# Altium project STM32F407VG.PrjPcb
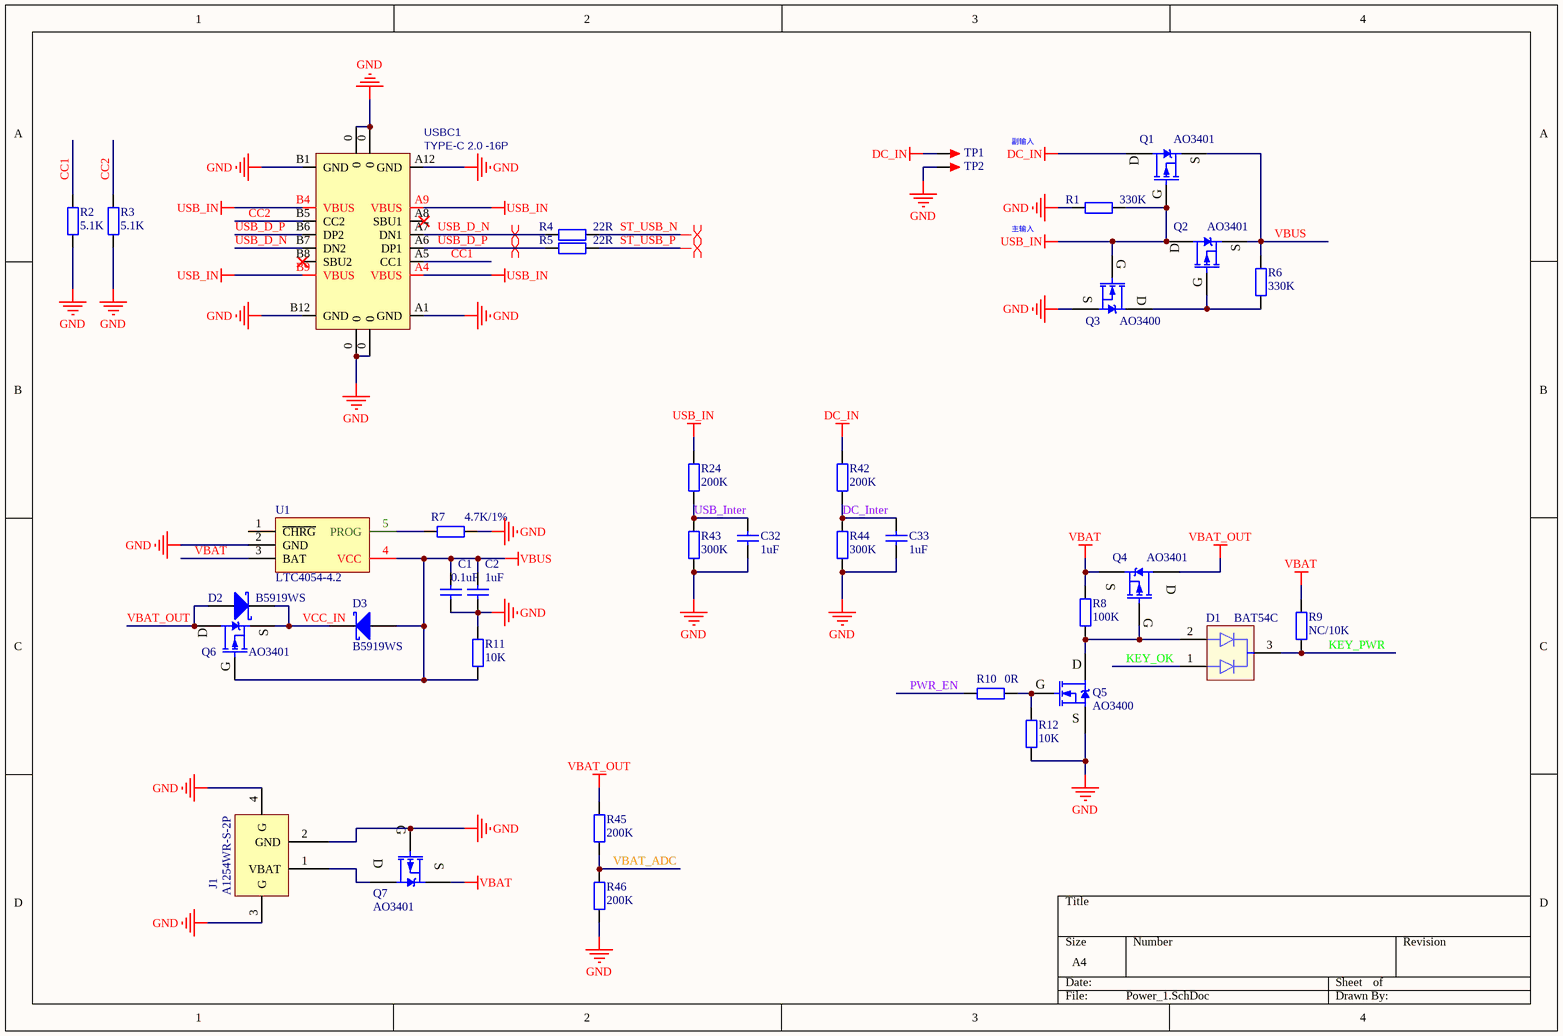
[diagram p0: Power_1.SchDoc]
8 sheets, 128 parts. Net scope: global (net labels, ports and power ports of the same name join across sheets).
Board files: STM32F407VG.PcbDoc, 板框.PcbDoc
Sheets:
  Power_1.SchDoc
  Power_2.SchDoc
  STM32F407VG_A.SchDoc
  STM32F407VG_B.SchDoc
  Flash.SchDoc
  SDCard.SchDoc
  ICM20608.SchDoc
  LCD_ADS131A04.SchDoc

## Sheet Power_1.SchDoc
size A4; SheetNumber: 1; SheetTotal: 8

### Parts
C1  0.1uF  [C0402_L]
C2  1uF  [C0402_L]
C32  1uF  [C0402_L]
C33  1uF  [C0402_L]
D1  BAT54C  [SOT23-3L]
D2  B5919WS  [SOD-123F]
D3  B5919WS  [SOD-123F]
J1  A1254WR-S-2P  [A1254WR-S-2P]
Q1  AO3401  [SOT23-3L]
Q2  AO3401  [SOT23-3L]
Q3  AO3400  [SOT23-3L]
Q4  AO3401  [SOT23-3L]
Q5  AO3400  [SOT23-3L]
Q6  AO3401  [SOT23-3L]
Q7  AO3401  [SOT23-3L]
R1  330K  [R0402_L]
R2  5.1K  [R0402_L]
R3  5.1K  [R0402_L]
R4  22R  [R0402_L]
R5  22R  [R0402_L]
R6  330K  [R0402_L]
R7  4.7K/1%  [R0402_L]
R8  100K  [R0402_L]
R9  NC/10K  [R0402_L]
R10  0R  [R0402_L]
R11  10K  [R0402_L]
R12  10K  [R0402_L]
R24  200K  [R0402_L]
R42  200K  [R0402_L]
R43  300K  [R0402_L]
R44  300K  [R0402_L]
R45  200K  [R0402_L]
R46  200K  [R0402_L]
TP1  TEST  [TEST 1]  (value not drawn)
TP2  TEST  [TEST 1]  (value not drawn)
U1  LTC4054-4.2  [SOT23-5L]
USBC1  TYPE-C 2.0 -16P  [USB-C-SMD_16P]

### Nets
DC_IN: Q1.3(D) R42.2 TP1.1
GND: C1.2 C2.2 C32.1 C33.1 J1.2(GND) J1.3(G) J1.4(G) Q3.2(S) Q5.2(S) Q7.1(G) R1.1 R2.1 R3.1 R7.2 R11.2 R12.2 R43.1 R44.1 R46.1 TP2.1 U1.2(GND) USBC1.0 USBC1.A1(GND) USBC1.A12(GND) USBC1.B1(GND) USBC1.B12(GND)
USB_IN: Q1.1(G) Q2.3(D) Q3.1(G) R1.2 R24.2 USBC1.A4(VBUS) USBC1.A9(VBUS) USBC1.B4(VBUS) USBC1.B9(VBUS)
VBAT: Q4.2(S) Q7.2(S) R8.2 R9.2 U1.3(BAT)
VBAT_OUT: D2.1(A) Q4.3(D) Q6.3(D) R45.2
VBUS: C1.1 C2.1 D3.1(A) Q1.2(S) Q2.2(S) Q6.1(G) R6.2 R11.1 U1.4(VCC)
VCC_IN: D2.2(K) D3.2(K) Q6.2(S)
CC1: R2.2 USBC1.A5(CC1)
CC2: R3.2 USBC1.B5(CC2)
DC_Inter: C33.2 R42.1 R44.2
KEY_OK: D1.1
KEY_PWR: D1.3 R9.1
PWR_EN: R10.2
ST_USB_N: R4.2
ST_USB_P: R5.2
USB_D_N: R4.1 USBC1.A7(DN1) USBC1.B7(DN2)
USB_D_P: R5.1 USBC1.A6(DP1) USBC1.B6(DP2)
USB_Inter: C32.2 R24.1 R43.2
VBAT_ADC: R45.1 R46.2  [project net ADC1_IN1]
NetD1_2: D1.2 Q4.1(G) Q5.3(D) R8.1
NetJ1_1: J1.1(VBAT) Q7.3(D)
NetQ2_1: Q2.1(G) Q3.3(D) R6.1
NetQ5_1: Q5.1(G) R10.1 R12.1
NetR7_1: R7.1 U1.5(PROG)

Not connected (* = marked no-connect by the designer): U1 1(~{CHRG}); USBC1 A8(SBU1)* B8(SBU2)*

### Layout directives
differential pair: ST_USB_N, ST_USB_P, USB_D_N, USB_D_P

### Notes on the sheet
- 副输入
- 主输入

### Library data of the parts
C1 C2 C32 C33 = C: 贴片电容; BOM名称: 无极性贴片电容; 联系卖家，免费查找封装: 唯一出售店铺网址https://shop463601444.taobao.com
D1 = BAT54C: 共阴肖特基二极管
D2 D3 = 1N5819: 肖特基二极管; 联系卖家，免费查找封装: 唯一出售店铺网址https://shop463601444.taobao.com; BOM名称: 肖特基二极管
J1 = A1254WR-S-2P: 长江连接器-卧式-2P
Q1 Q2 Q4 Q6 Q7 = AO3401: P沟道 30V/4.2A; BOM名称: 场效应管; 联系卖家，免费查找封装: 唯一出售店铺网址https://shop463601444.taobao.com; 参数: P沟道 30V/4.2A
Q3 Q5 = AO3400: N沟道 30V/4.2A; BOM名称: 场效应管; 联系卖家，免费查找封装: 唯一出售店铺网址https://shop463601444.taobao.com; 参数: N沟道 30V/4.2A
R1-R12 R24 R42-R46 = R: 贴片电阻; 联系卖家，免费查找封装: 唯一出售店铺网址https://shop463601444.taobao.com; BOM名称: 贴片电阻
TP1 TP2 = TEST: 测试点; 联系卖家，免费查找封装: 唯一出售店铺网址https://shop463601444.taobao.com; 封装库来自淘宝卖家ID：黄晶宝石: 其他店铺购入均为盗版假冒封装库，请立即申请退款; BOM名称: 测试点
U1 = LTC4054-4.2: 锂电池充电IC
USBC1 = USB2.0_Type-C_16Pin: USB2.0_Type-C_16Pin母座; 联系卖家 免费查找封装: 唯一出售店铺网址https://shop463601444.taobao.com; 联系卖家 免费技术支持: 封装库来自淘宝卖家ID：黄晶宝石

## Sheet Power_2.SchDoc
size A4; SheetNumber: 2; SheetTotal: 8
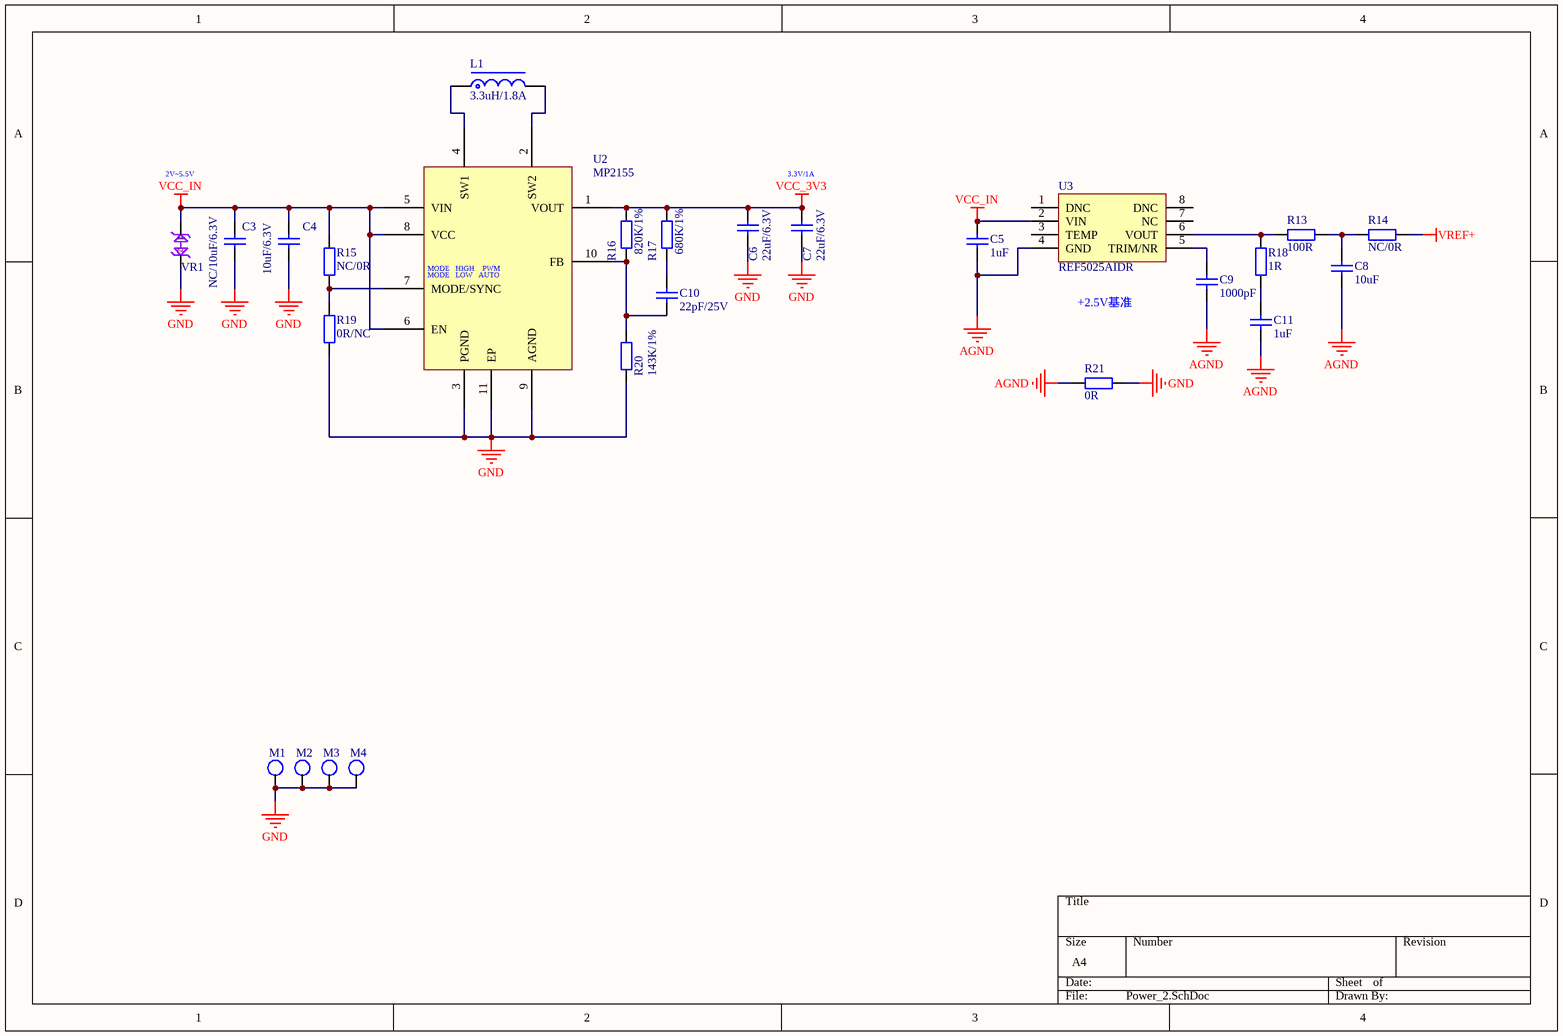
[diagram p1: Power_2.SchDoc]

### Parts
C3  NC/10uF/6.3V  [C0603_L]
C4  10uF/6.3V  [C0603_L]
C5  1uF  [C0402_L]
C6  22uF/6.3V  [C0603_L]
C7  22uF/6.3V  [C0603_L]
C8  10uF  [C0603_L]
C9  1000pF  [C0402_L]
C10  22pF/25V  [C0402_L]
C11  1uF  [C0402_L]
L1  3.3uH/1.8A  [NR2520]
M1  M2  [M2]  (value not drawn)
M2  M2  [M2]  (value not drawn)
M3  M2  [M2]  (value not drawn)
M4  M2  [M2]  (value not drawn)
R13  100R  [R0402_L]
R14  NC/0R  [R0402_L]
R15  NC/0R  [R0402_L]
R16  820K/1%  [R0402_L]
R17  680K/1%  [R0402_L]
R18  1R  [R0402_L]
R19  0R/NC  [R0402_L]
R20  143K/1%  [R0402_L]
R21  0R  [R0402_L]
U2  MP2155  [QFN10(3mmX3mm)]
U3  REF5025AIDR  [SOIC-8L]
VR1  UAD8C05L01  [SOD882]  (value not drawn)

### Nets
AGND: C5.1 C8.1 C9.1 C11.1 R21.1 U3.4(GND)
GND: C3.1 C4.1 C6.1 C7.1 M1.1 M2.1 M3.1 M4.1 R19.1 R20.1 R21.2 U2.3(PGND) U2.9(AGND) U2.11(EP) VR1.2
VCC_3V3: C6.2 C7.2 R16.2 R17.2 U2.1(VOUT)
VCC_IN: C3.2 C4.2 C5.2 R15.2 U2.5(VIN) U2.6(EN) U2.8(VCC) U3.2(VIN) VR1.1
VREF+: R14.2
NetC8_2: C8.2 R13.2 R14.1
NetC9_2: C9.2 U3.5(TRIM/NR)
NetC10_1: C10.1 R16.1 R20.2 U2.10(FB)
NetC10_2: C10.2 R17.1
NetC11_2: C11.2 R18.1
NetL1_1: L1.1 U2.4(SW1)
NetL1_2: L1.2 U2.2(SW2)
NetR13_1: R13.1 R18.2 U3.6(VOUT)
NetR15_1: R15.1 R19.2 U2.7(MODE/SYNC)

Not connected (* = marked no-connect by the designer): U3 1(DNC) 3(TEMP) 7(NC) 8(DNC)

### Notes on the sheet
- 2V~5.5V
- 3.3V/1A
- (near U2) MODE   HIGH    PWM
- (near U2) MODE   LOW   AUTO
- +2.5V基准

### Library data of the parts
C3-C11 = C: as C1 on sheet Power_1
L1 = L-NR: 太诱-NR磁胶电感; BOM名称: NR磁胶电感; 联系卖家，免费查找封装: 唯一出售店铺网址https://shop463601444.taobao.com
M1-M4 = M2系列: M2孔支撑柱
R13-R21 = R: as R1 on sheet Power_1; BOM名称: 贴片电阻
U2 = MP2155: 高效、低静态电流的Buck-Boost变换器
U3 = REF5025AIDR: 3uVpp/V噪声 3ppm/℃漂移 电压基准 0.05%

## Sheet STM32F407VG_A.SchDoc
size A4; SheetNumber: 3; SheetTotal: 8
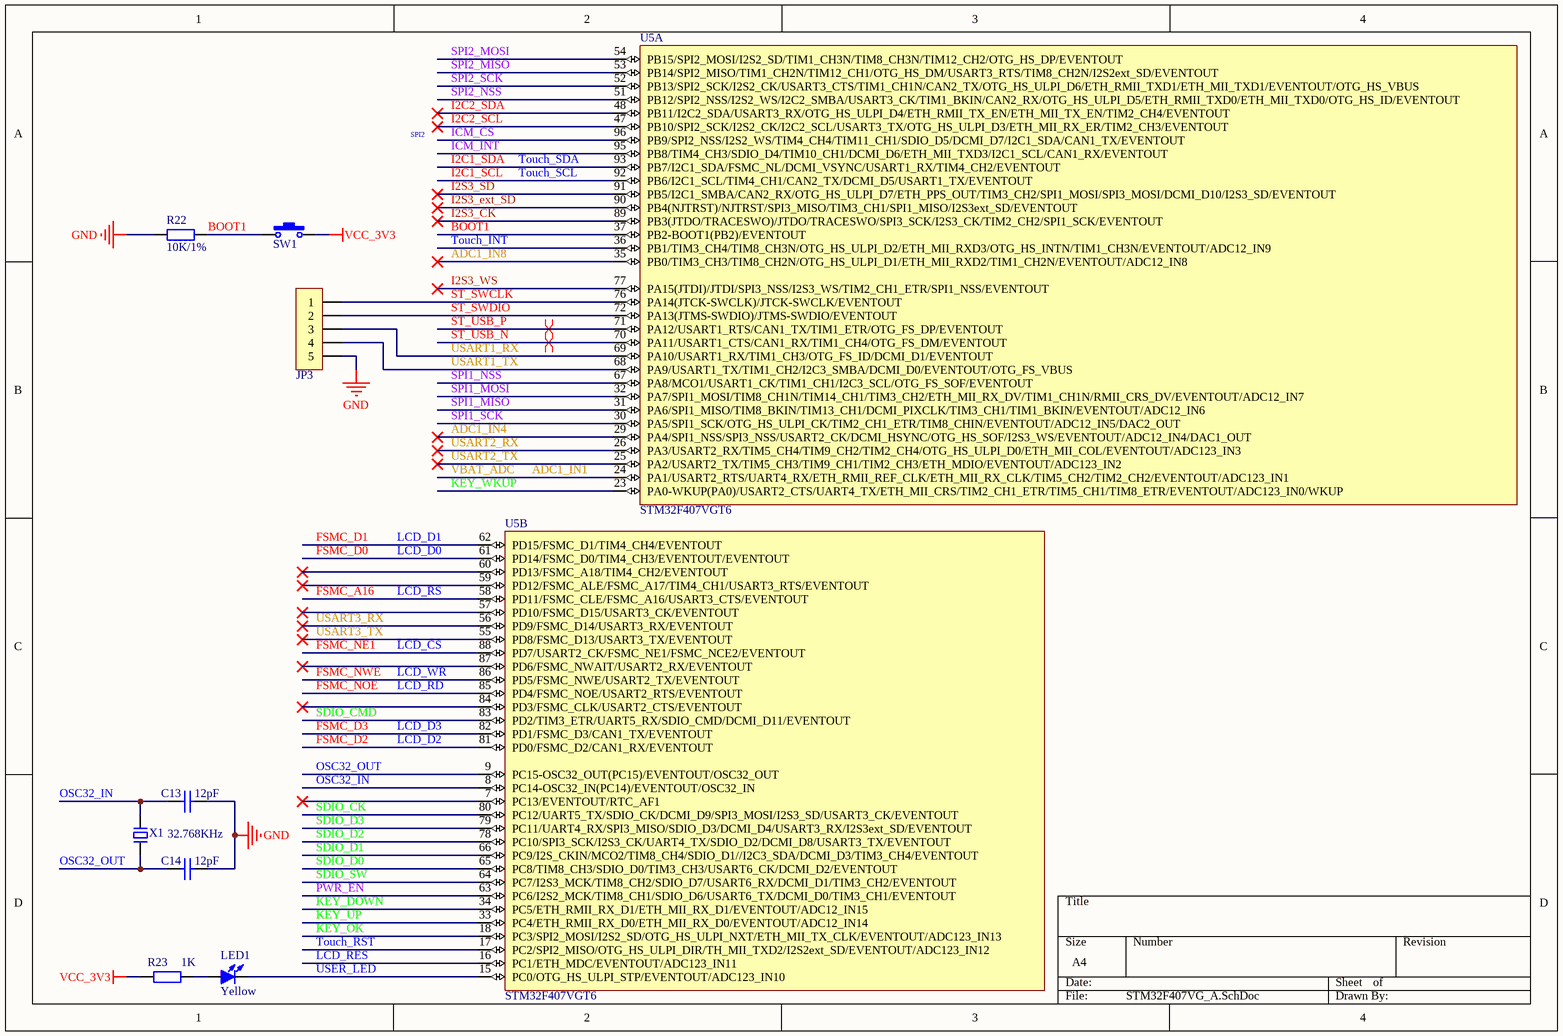
[diagram p2: STM32F407VG_A.SchDoc]

### Parts
C13  12pF  [C0402_L]
C14  12pF  [C0402_L]
JP3  HDR-1X5  [HDR1.27-LI-5P]  (value not drawn)
LED1  Yellow  [LED0402]
R22  10K/1%  [R0402_L]
R23  1K  [R0402_L]
SW1  小龟按键  [3*4两脚小龟按键]  (value not drawn)
U5  STM32F407VGT6  [LQFP100_L]  (parts A,B of 5)
X1  32.768KHz  [XTAL-3215-2P]

### Nets
GND: C13.1 C14.1 JP3.5 R22.1
VCC_3V3: R23.1 SW1.2
ADC1_IN1: U5.24(PA1/USART2_RTS/UART4_RX/ETH_RMII_REF_CLK/ETH_MII_RX_CLK/TIM5_CH2/TIM2_CH2/EVENTOUT/ADC123_IN1)  [also labelled VBAT_ADC]
ADC1_IN4: U5.29(PA4/SPI1_NSS/SPI3_NSS/USART2_CK/DCMI_HSYNC/OTG_HS_SOF/I2S3_WS/EVENTOUT/ADC12_IN4/DAC1_OUT)
ADC1_IN8: U5.35(PB0/TIM3_CH3/TIM8_CH2N/OTG_HS_ULPI_D1/ETH_MII_RXD2/TIM1_CH2N/EVENTOUT/ADC12_IN8)
BOOT1: R22.2 SW1.1 U5.37(PB2-BOOT1(PB2)/EVENTOUT)
FSMC_A16: U5.58(PD11/FSMC_CLE/FSMC_A16/USART3_CTS/EVENTOUT)  [also labelled LCD_RS]
FSMC_D0: U5.61(PD14/FSMC_D0/TIM4_CH3/EVENTOUT/EVENTOUT)  [also labelled LCD_D0]
FSMC_D1: U5.62(PD15/FSMC_D1/TIM4_CH4/EVENTOUT)  [also labelled LCD_D1]
FSMC_D2: U5.81(PD0/FSMC_D2/CAN1_RX/EVENTOUT)  [also labelled LCD_D2]
FSMC_D3: U5.82(PD1/FSMC_D3/CAN1_TX/EVENTOUT)  [also labelled LCD_D3]
FSMC_NE1: U5.88(PD7/USART2_CK/FSMC_NE1/FSMC_NCE2/EVENTOUT)  [also labelled LCD_CS]
FSMC_NOE: U5.85(PD4/FSMC_NOE/USART2_RTS/EVENTOUT)  [also labelled LCD_RD]
FSMC_NWE: U5.86(PD5/FSMC_NWE/USART2_TX/EVENTOUT)  [also labelled LCD_WR]
I2C1_SCL: U5.92(PB6/I2C1_SCL/TIM4_CH1/CAN2_TX/DCMI_D5/USART1_TX/EVENTOUT)  [also labelled Touch_SCL]
I2C1_SDA: U5.93(PB7/I2C1_SDA/FSMC_NL/DCMI_VSYNC/USART1_RX/TIM4_CH2/EVENTOUT)  [also labelled Touch_SDA]
I2C2_SCL: U5.47(PB10/SPI2_SCK/I2S2_CK/I2C2_SCL/USART3_TX/OTG_HS_ULPI_D3/ETH_MII_RX_ER/TIM2_CH3/EVENTOUT)
I2C2_SDA: U5.48(PB11/I2C2_SDA/USART3_RX/OTG_HS_ULPI_D4/ETH_RMII_TX_EN/ETH_MII_TX_EN/TIM2_CH4/EVENTOUT)
I2S3_CK: U5.89(PB3(JTDO/TRACESWO)/JTDO/TRACESWO/SPI3_SCK/I2S3_CK/TIM2_CH2/SPI1_SCK/EVENTOUT)
I2S3_ext_SD: U5.90(PB4(NJTRST)/NJTRST/SPI3_MISO/TIM3_CH1/SPI1_MISO/I2S3ext_SD/EVENTOUT)
I2S3_SD: U5.91(PB5/I2C1_SMBA/CAN2_RX/OTG_HS_ULPI_D7/ETH_PPS_OUT/TIM3_CH2/SPI1_MOSI/SPI3_MOSI/DCMI_D10/I2S3_SD/EVENTOUT)
I2S3_WS: U5.77(PA15(JTDI)/JTDI/SPI3_NSS/I2S3_WS/TIM2_CH1_ETR/SPI1_NSS/EVENTOUT)
ICM_CS: U5.96(PB9/SPI2_NSS/I2S2_WS/TIM4_CH4/TIM11_CH1/SDIO_D5/DCMI_D7/I2C1_SDA/CAN1_TX/EVENTOUT)
ICM_INT: U5.95(PB8/TIM4_CH3/SDIO_D4/TIM10_CH1/DCMI_D6/ETH_MII_TXD3/I2C1_SCL/CAN1_RX/EVENTOUT)
KEY_DOWN: U5.34(PC5/ETH_RMII_RX_D1/ETH_MII_RX_D1/EVENTOUT/ADC12_IN15)
KEY_OK: U5.18(PC3/SPI2_MOSI/I2S2_SD/OTG_HS_ULPI_NXT/ETH_MII_TX_CLK/EVENTOUT/ADC123_IN13)
KEY_UP: U5.33(PC4/ETH_RMII_RX_D0/ETH_MII_RX_D0/EVENTOUT/ADC12_IN14)
KEY_WKUP: U5.23(PA0-WKUP(PA0)/USART2_CTS/UART4_TX/ETH_MII_CRS/TIM2_CH1_ETR/TIM5_CH1/TIM8_ETR/EVENTOUT/ADC123_IN0/WKUP)
LCD_RES: U5.16(PC1/ETH_MDC/EVENTOUT/ADC123_IN11)
OSC32_IN: C13.2 U5.8(PC14-OSC32_IN(PC14)/EVENTOUT/OSC32_IN) X1.2
OSC32_OUT: C14.2 U5.9(PC15-OSC32_OUT(PC15)/EVENTOUT/OSC32_OUT) X1.1
PWR_EN: U5.63(PC6/I2S2_MCK/TIM8_CH1/SDIO_D6/USART6_TX/DCMI_D0/TIM3_CH1/EVENTOUT)
SDIO_CK: U5.80(PC12/UART5_TX/SDIO_CK/DCMI_D9/SPI3_MOSI/I2S3_SD/USART3_CK/EVENTOUT)
SDIO_CMD: U5.83(PD2/TIM3_ETR/UART5_RX/SDIO_CMD/DCMI_D11/EVENTOUT)
SDIO_D0: U5.65(PC8/TIM8_CH3/SDIO_D0/TIM3_CH3/USART6_CK/DCMI_D2/EVENTOUT)
SDIO_D1: U5.66(PC9/I2S_CKIN/MCO2/TIM8_CH4/SDIO_D1//I2C3_SDA/DCMI_D3/TIM3_CH4/EVENTOUT)
SDIO_D2: U5.78(PC10/SPI3_SCK/I2S3_CK/UART4_TX/SDIO_D2/DCMI_D8/USART3_TX/EVENTOUT)
SDIO_D3: U5.79(PC11/UART4_RX/SPI3_MISO/SDIO_D3/DCMI_D4/USART3_RX/I2S3ext_SD/EVENTOUT)
SDIO_SW: U5.64(PC7/I2S3_MCK/TIM8_CH2/SDIO_D7/USART6_RX/DCMI_D1/TIM3_CH2/EVENTOUT)
SPI1_MISO: U5.31(PA6/SPI1_MISO/TIM8_BKIN/TIM13_CH1/DCMI_PIXCLK/TIM3_CH1/TIM1_BKIN/EVENTOUT/ADC12_IN6)
SPI1_MOSI: U5.32(PA7/SPI1_MOSI/TIM8_CH1N/TIM14_CH1/TIM3_CH2/ETH_MII_RX_DV/TIM1_CH1N/RMII_CRS_DV/EVENTOUT/ADC12_IN7)
SPI1_NSS: U5.67(PA8/MCO1/USART1_CK/TIM1_CH1/I2C3_SCL/OTG_FS_SOF/EVENTOUT)
SPI1_SCK: U5.30(PA5/SPI1_SCK/OTG_HS_ULPI_CK/TIM2_CH1_ETR/TIM8_CHIN/EVENTOUT/ADC12_IN5/DAC2_OUT)
SPI2_MISO: U5.53(PB14/SPI2_MISO/TIM1_CH2N/TIM12_CH1/OTG_HS_DM/USART3_RTS/TIM8_CH2N/I2S2ext_SD/EVENTOUT)
SPI2_MOSI: U5.54(PB15/SPI2_MOSI/I2S2_SD/TIM1_CH3N/TIM8_CH3N/TIM12_CH2/OTG_HS_DP/EVENTOUT)
SPI2_NSS: U5.51(PB12/SPI2_NSS/I2S2_WS/I2C2_SMBA/USART3_CK/TIM1_BKIN/CAN2_RX/OTG_HS_ULPI_D5/ETH_RMII_TXD0/ETH_MII_TXD0/OTG_HS_ID/EVENTOUT)
SPI2_SCK: U5.52(PB13/SPI2_SCK/I2S2_CK/USART3_CTS/TIM1_CH1N/CAN2_TX/OTG_HS_ULPI_D6/ETH_RMII_TXD1/ETH_MII_TXD1/EVENTOUT/OTG_HS_VBUS)
ST_SWCLK: JP3.1 U5.76(PA14(JTCK-SWCLK)/JTCK-SWCLK/EVENTOUT)
ST_SWDIO: JP3.2 U5.72(PA13(JTMS-SWDIO)/JTMS-SWDIO/EVENTOUT)
ST_USB_N: U5.70(PA11/USART1_CTS/CAN1_RX/TIM1_CH4/OTG_FS_DM/EVENTOUT)
ST_USB_P: U5.71(PA12/USART1_RTS/CAN1_TX/TIM1_ETR/OTG_FS_DP/EVENTOUT)
Touch_INT: U5.36(PB1/TIM3_CH4/TIM8_CH3N/OTG_HS_ULPI_D2/ETH_MII_RXD3/OTG_HS_INTN/TIM1_CH3N/EVENTOUT/ADC12_IN9)
Touch_RST: U5.17(PC2/SPI2_MISO/OTG_HS_ULPI_DIR/TH_MII_TXD2/I2S2ext_SD/EVENTOUT/ADC123_IN12)
USART1_RX: JP3.3 U5.69(PA10/USART1_RX/TIM1_CH3/OTG_FS_ID/DCMI_D1/EVENTOUT)
USART1_TX: JP3.4 U5.68(PA9/USART1_TX/TIM1_CH2/I2C3_SMBA/DCMI_D0/EVENTOUT/OTG_FS_VBUS)
USART2_RX: U5.26(PA3/USART2_RX/TIM5_CH4/TIM9_CH2/TIM2_CH4/OTG_HS_ULPI_D0/ETH_MII_COL/EVENTOUT/ADC123_IN3)
USART2_TX: U5.25(PA2/USART2_TX/TIM5_CH3/TIM9_CH1/TIM2_CH3/ETH_MDIO/EVENTOUT/ADC123_IN2)
USART3_RX: U5.56(PD9/FSMC_D14/USART3_RX/EVENTOUT)
USART3_TX: U5.55(PD8/FSMC_D13/USART3_TX/EVENTOUT)
USER_LED: LED1.2(K) U5.15(PC0/OTG_HS_ULPI_STP/EVENTOUT/ADC123_IN10)
NetLED1_1: LED1.1(A) R23.2

Not connected (* = marked no-connect by the designer): U5 7(PC13/EVENTOUT/RTC_AF1)* 57(PD10/FSMC_D15/USART3_CK/EVENTOUT)* 59(PD12/FSMC_ALE/FSMC_A17/TIM4_CH1/USART3_RTS/EVENTOUT)* 60(PD13/FSMC_A18/TIM4_CH2/EVENTOUT)* 84(PD3/FSMC_CLK/USART2_CTS/EVENTOUT)* 87(PD6/FSMC_NWAIT/USART2_RX/EVENTOUT)*

### Layout directives
differential pair: ST_USB_N, ST_USB_P

### Notes on the sheet
- SPI2

### Library data of the parts
C13 C14 = C: as C1 on sheet Power_1
JP3 = Header 5: 5P接插件; 封装库来自淘宝卖家 ID：黄晶宝石: https://shop463601444.taobao.com
LED1 = LED-SMD: 贴片LED; 联系卖家 免费查找封装: 封装库来自淘宝卖家ID：黄晶宝石; BOM名称: 贴片LED
R22 R23 = R: as R1 on sheet Power_1; BOM名称: 贴片电阻
SW1 = SW-PB: 微动开关; BOM名称: 3x6轻触开关; 联系卖家，免费查找封装: 唯一出售店铺网址https://shop463601444.taobao.com; 封装库来自淘宝卖家ID：黄晶宝石: 其他店铺购入均为盗版假冒封装库，请立即申请退款
U5 = STM32F407VGT6: ARM Cortex-M4 32b MCU+FPU, 210DMIP, 1024 kB Flash, 192+4 kB RAM, Camera, 82 I/Os, 100-pin LQFP, -40 to +85癈, Tray; Internal RAM: 192kB; Operating Frequency (Processor Speed): 168MHz; A/D Converter: 16x12-bit; D/A Converter: 2x12-bit; 16-bit Timers (IC/OC/PWM): 12x16-bit(24/24/30); 32-bit Timer (IC/OC/PWM): 2x32-bit (8/8/8); Other Timer Functions: 2xWDG, RTC, 24-bit down counter; Serial Interface: 3xSPI/2xI2S/2xI2C/3xUSART(IrDa, ISO7816)/3xUART/2xUSB OTG FS/HS, 2xCAN/Ethernet MAC10/100, SDIO; 联系卖家，免费查找封装: 唯一出售店铺网址https://shop463601444.taobao.com; DatasheetVersion: rev2, Jan-2012; PackageVersion: 2012; PackageReference: LQFP100; PackageDescription: 100-Pin Low Profile Quad Flat Package, 14x14 mm Body, 0.5 mm Pitch; ComponentLink1Description: Manufacturer URL; ComponentLink1URL: http://www.st.com/; ComponentLink2Description: STM32F405/7 Datasheet; ComponentLink2URL: http://www.st.com/internet/com/TECHNICAL_RESOURCES/TECHNICAL_LITERATURE/DATASHEET/DM00037051.pdf; ComponentLink3Description: STM32F4 Web Page; ComponentLink3URL: http://www.st.com/internet/mcu/subclass/1521.jsp
X1 = XTAL-2P: 2脚无源晶振(谐振器）; 联系卖家，免费查找封装: 唯一出售店铺网址https://shop463601444.taobao.com; BOM名称: 2脚无源晶振(谐振器）

## Sheet STM32F407VG_B.SchDoc
size A4; SheetNumber: 4; SheetTotal: 8
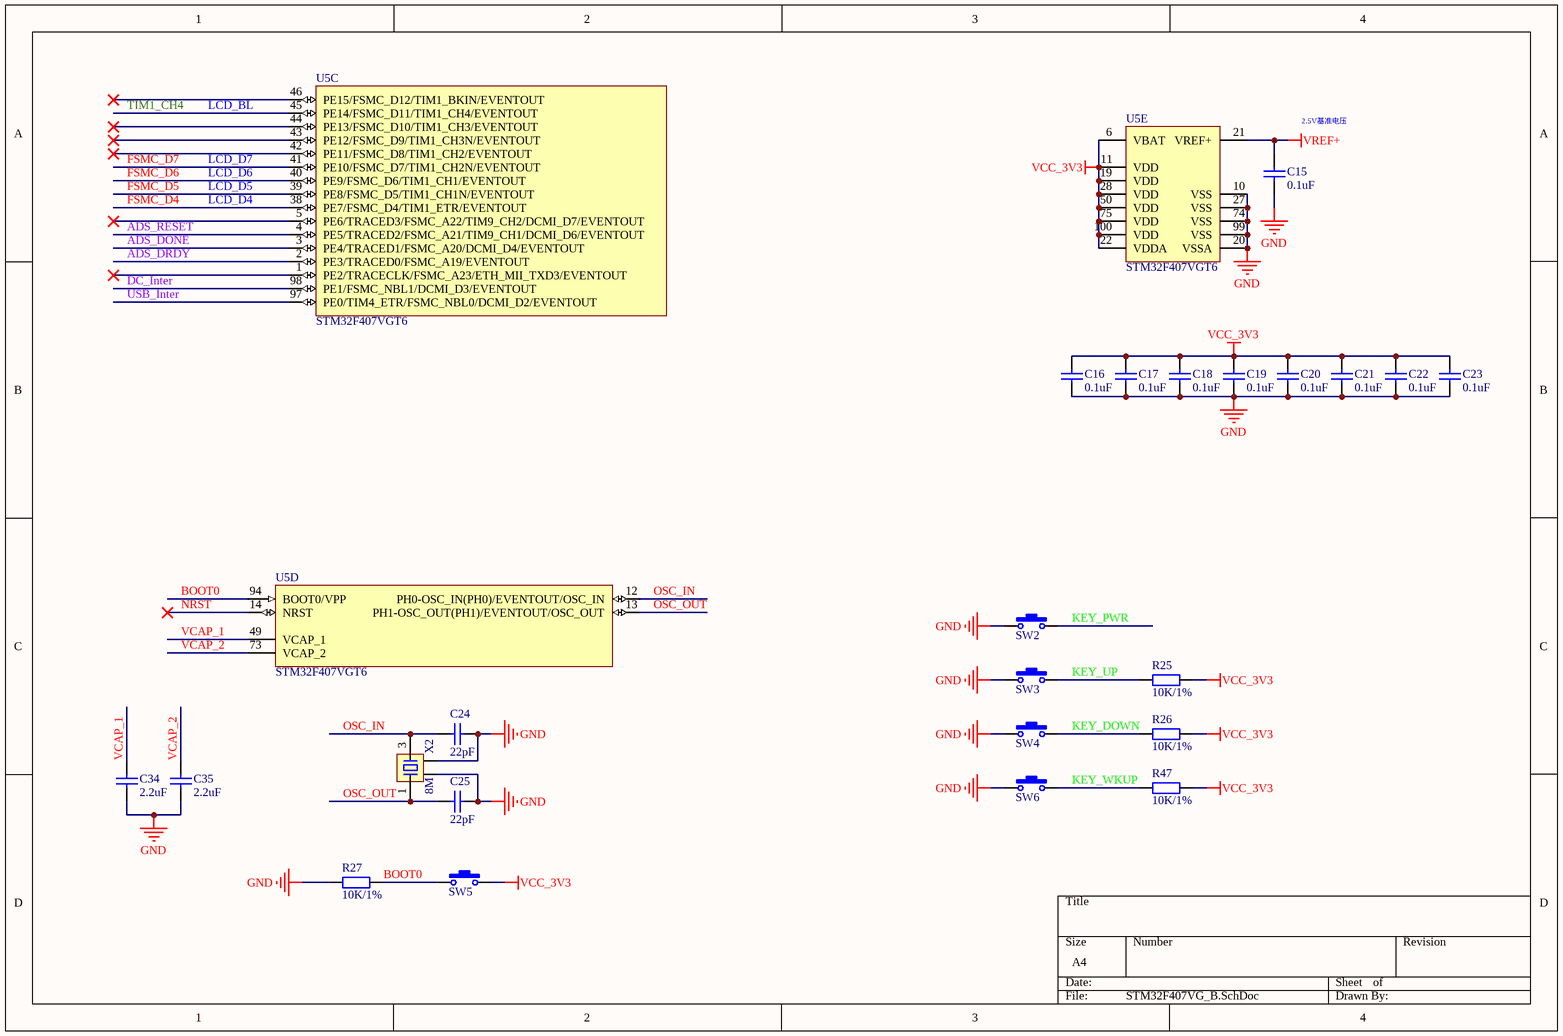
[diagram p3: STM32F407VG_B.SchDoc]

### Parts
C15  0.1uF  [C0402_L]
C16  0.1uF  [C0402_L]
C17  0.1uF  [C0402_L]
C18  0.1uF  [C0402_L]
C19  0.1uF  [C0402_L]
C20  0.1uF  [C0402_L]
C21  0.1uF  [C0402_L]
C22  0.1uF  [C0402_L]
C23  0.1uF  [C0402_L]
C24  22pF  [C0402_L]
C25  22pF  [C0402_L]
C34  2.2uF  [C0402_L]
C35  2.2uF  [C0402_L]
R25  10K/1%  [R0402_L]
R26  10K/1%  [R0402_L]
R27  10K/1%  [R0402_L]
R47  10K/1%  [R0402_L]
SW2  小龟按键  [2*4*3.5]  (value not drawn)
SW3  小龟按键  [2*4*3.5]  (value not drawn)
SW4  小龟按键  [2*4*3.5]  (value not drawn)
SW5  小龟按键  [3*4两脚小龟按键]  (value not drawn)
SW6  小龟按键  [2*4*3.5]  (value not drawn)
U5  STM32F407VGT6  [LQFP100_L]  (parts C,D,E of 5)
X2  8M  [XTAL-3225-4P]

### Nets
GND: C15.1 C16.1 C17.1 C18.1 C19.1 C20.1 C21.1 C22.1 C23.1 C24.2 C25.2 C34.1 C35.1 R27.1 SW2.1 SW3.1 SW4.1 SW6.1 U5.10(VSS) U5.20(VSSA) U5.27(VSS) U5.74(VSS) U5.99(VSS) X2.2 X2.4
VCC_3V3: C16.2 C17.2 C18.2 C19.2 C20.2 C21.2 C22.2 C23.2 R25.2 R26.2 R47.2 SW5.2 U5.6(VBAT) U5.11(VDD) U5.19(VDD) U5.22(VDDA) U5.28(VDD) U5.50(VDD) U5.75(VDD) U5.100(VDD)
VREF+: C15.2 U5.21(VREF+)
ADS_DONE: U5.3(PE4/TRACED1/FSMC_A20/DCMI_D4/EVENTOUT)
ADS_DRDY: U5.2(PE3/TRACED0/FSMC_A19/EVENTOUT)
ADS_RESET: U5.4(PE5/TRACED2/FSMC_A21/TIM9_CH1/DCMI_D6/EVENTOUT)
BOOT0: R27.2 SW5.1 U5.94(BOOT0/VPP)
DC_Inter: U5.98(PE1/FSMC_NBL1/DCMI_D3/EVENTOUT)
FSMC_D4: U5.38(PE7/FSMC_D4/TIM1_ETR/EVENTOUT)  [also labelled LCD_D4]
FSMC_D5: U5.39(PE8/FSMC_D5/TIM1_CH1N/EVENTOUT)  [also labelled LCD_D5]
FSMC_D6: U5.40(PE9/FSMC_D6/TIM1_CH1/EVENTOUT)  [also labelled LCD_D6]
FSMC_D7: U5.41(PE10/FSMC_D7/TIM1_CH2N/EVENTOUT)  [also labelled LCD_D7]
KEY_DOWN: R26.1 SW4.2
KEY_PWR: SW2.2
KEY_UP: R25.1 SW3.2
KEY_WKUP: R47.1 SW6.2
LCD_BL: U5.45(PE14/FSMC_D11/TIM1_CH4/EVENTOUT)  [also labelled TIM1_CH4]
NRST: U5.14(NRST)
OSC_IN: C24.1 U5.12(PH0-OSC_IN(PH0)/EVENTOUT/OSC_IN) X2.3
OSC_OUT: C25.1 U5.13(PH1-OSC_OUT(PH1)/EVENTOUT/OSC_OUT) X2.1
USB_Inter: U5.97(PE0/TIM4_ETR/FSMC_NBL0/DCMI_D2/EVENTOUT)
VCAP_1: C34.2 U5.49(VCAP_1)
VCAP_2: C35.2 U5.73(VCAP_2)

Not connected (* = marked no-connect by the designer): U5 1(PE2/TRACECLK/FSMC_A23/ETH_MII_TXD3/EVENTOUT)* 5(PE6/TRACED3/FSMC_A22/TIM9_CH2/DCMI_D7/EVENTOUT)* 42(PE11/FSMC_D8/TIM1_CH2/EVENTOUT)* 43(PE12/FSMC_D9/TIM1_CH3N/EVENTOUT)* 44(PE13/FSMC_D10/TIM1_CH3/EVENTOUT)* 46(PE15/FSMC_D12/TIM1_BKIN/EVENTOUT)*

### Notes on the sheet
- (near C15) 2.5V基准电压

### Library data of the parts
C15-C25 C34 C35 = C: as C1 on sheet Power_1
R25-R27 R47 = R: as R1 on sheet Power_1; BOM名称: 贴片电阻
SW2-SW6 = SW-PB: as SW1 on sheet STM32F407VG_A
U5 = STM32F407VGT6: as U5 on sheet STM32F407VG_A; DatasheetVersion: rev2, Jan-2012; PackageVersion: 2012; PackageReference: LQFP100; PackageDescription: 100-Pin Low Profile Quad Flat Package, 14x14 mm Body, 0.5 mm Pitch; ComponentLink1Description: Manufacturer URL; ComponentLink1URL: http://www.st.com/; ComponentLink2Description: STM32F405/7 Datasheet; ComponentLink2URL: http://www.st.com/internet/com/TECHNICAL_RESOURCES/TECHNICAL_LITERATURE/DATASHEET/DM00037051.pdf; ComponentLink3Description: STM32F4 Web Page; ComponentLink3URL: http://www.st.com/internet/mcu/subclass/1521.jsp
X2 = XTAL-4P: 4脚无源晶振(谐振器）; 联系卖家，免费查找封装: 唯一出售店铺网址https://shop463601444.taobao.com; BOM名称: 4脚无源晶振(谐振器）

## Sheet Flash.SchDoc
size A4; SheetNumber: 5; SheetTotal: 8
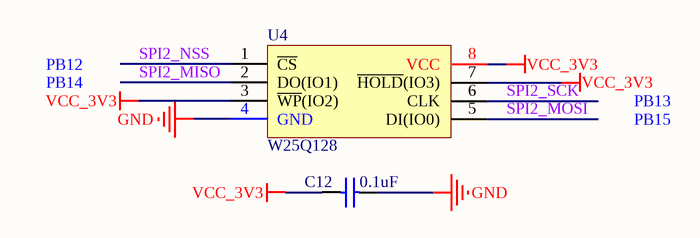
[diagram p4: Flash.SchDoc]

### Parts
C12  0.1uF  [C0402_L]
U4  W25Q128  [WSON 6x5mm]

### Nets
GND: C12.1 U4.4(GND)
VCC_3V3: C12.2 U4.3(~{WP}(IO2)) U4.7(~{HOLD}(IO3)) U4.8(VCC)
SPI2_MISO: U4.2(DO(IO1))
SPI2_MOSI: U4.5(DI(IO0))
SPI2_NSS: U4.1(~{CS})
SPI2_SCK: U4.6(CLK)

### Notes on the sheet
- PB14
- PB12
- PB15
- PB13

### Library data of the parts
C12 = C: as C1 on sheet Power_1
U4 = W25Qxx: SPI Flash

## Sheet SDCard.SchDoc
size A4; SheetNumber: 6; SheetTotal: 8
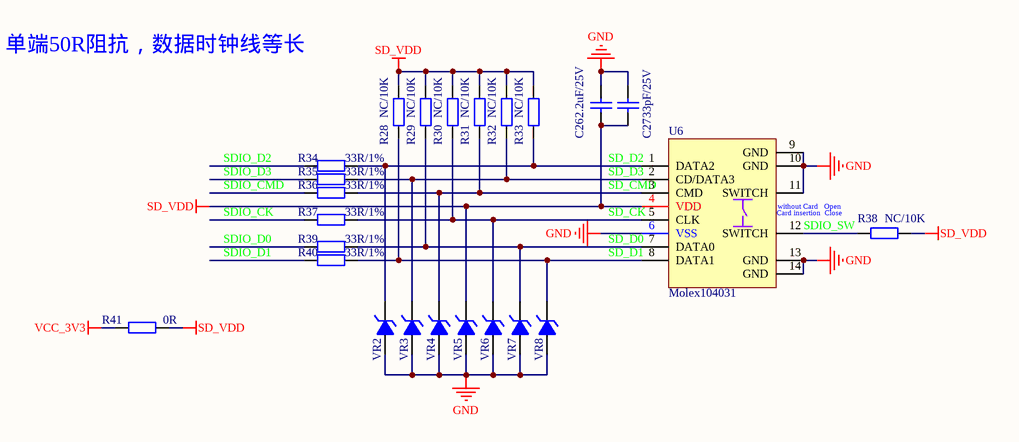
[diagram p5: SDCard.SchDoc]

### Parts
C26  2.2uF/25V  [C0402_L]
C27  33pF/25V  [C0402_L]
R28  NC/10K  [R0402_L]
R29  NC/10K  [R0402_L]
R30  NC/10K  [R0402_L]
R31  NC/10K  [R0402_L]
R32  NC/10K  [R0402_L]
R33  NC/10K  [R0402_L]
R34  33R/1%  [R0402_L]
R35  33R/1%  [R0402_L]
R36  33R/1%  [R0402_L]
R37  33R/1%  [R0402_L]
R38  NC/10K  [R0402_L]
R39  33R/1%  [R0402_L]
R40  33R/1%  [R0402_L]
R41  0R  [R0402_L]
U6  Molex104031  [插拔式MicroSD卡]
VR2  ESD9D5U  [SOD-923]  (value not drawn)
VR3  ESD9D5U  [SOD-923]  (value not drawn)
VR4  ESD9D5U  [SOD-923]  (value not drawn)
VR5  ESD9D5U  [SOD-923]  (value not drawn)
VR6  ESD9D5U  [SOD-923]  (value not drawn)
VR7  ESD9D5U  [SOD-923]  (value not drawn)
VR8  ESD9D5U  [SOD-923]  (value not drawn)

### Nets
GND: C26.2 C27.2 U6.6(VSS) U6.9(GND) U6.10(GND) U6.11(SWITCH) U6.13(GND) U6.14(GND) VR2.2(A) VR3.2(A) VR4.2(A) VR5.2(A) VR6.2(A) VR7.2(A) VR8.2(A)
SD_VDD: C26.1 C27.1 R28.2 R29.2 R30.2 R31.2 R32.2 R33.2 R38.1 R41.2 U6.4(VDD) VR5.1(K)
VCC_3V3: R41.1
SD_CK: R30.1 R37.2 U6.5(CLK) VR6.1(K)
SD_CMD: R31.1 R36.2 U6.3(CMD) VR4.1(K)
SD_D0: R29.1 R39.2 U6.7(DATA0) VR7.1(K)
SD_D1: R28.1 R40.2 U6.8(DATA1) VR8.1(K)
SD_D2: R33.1 R34.2 U6.1(DATA2) VR2.1(K)
SD_D3: R32.1 R35.2 U6.2(CD/DATA3) VR3.1(K)
SDIO_CK: R37.1
SDIO_CMD: R36.1
SDIO_D0: R39.1
SDIO_D1: R40.1
SDIO_D2: R34.1
SDIO_D3: R35.1
SDIO_SW: R38.2 U6.12(SWITCH)

### Notes on the sheet
- 单端50R阻抗，数据时钟线等长
- (near U6) without Card   Open
- (near U6) Card insertion  Close

### Library data of the parts
C26 C27 = C: as C1 on sheet Power_1
R28-R41 = R: as R1 on sheet Power_1; BOM名称: 贴片电阻
U6 = Molex104031: 拔插式超薄TF卡座
VR2-VR8 = Diode4: 瞬态电压抑制二极管; pin to pad: 1>2 2>1

## Sheet ICM20608.SchDoc
size A4; SheetNumber: 7; SheetTotal: 8
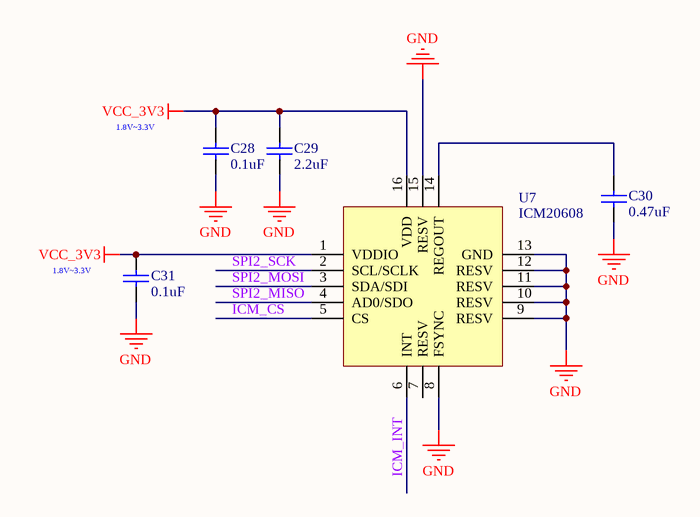
[diagram p6: ICM20608.SchDoc]

### Parts
C28  0.1uF  [C0402_L]
C29  2.2uF  [C0402_L]
C30  0.47uF  [C0402_L]
C31  0.1uF  [C0402_L]
U7  ICM20608  [LGA16     3*3*0.75]

### Nets
GND: C28.1 C29.1 C30.2 C31.2 U7.8(FSYNC) U7.9(RESV) U7.10(RESV) U7.11(RESV) U7.12(RESV) U7.13(GND) U7.15(RESV)
VCC_3V3: C28.2 C29.2 C31.1 U7.1(VDDIO) U7.16(VDD)
ICM_CS: U7.5(CS)
ICM_INT: U7.6(INT)
SPI2_MISO: U7.4(AD0/SDO)
SPI2_MOSI: U7.3(SDA/SDI)
SPI2_SCK: U7.2(SCL/SCLK)
NetC30_1: C30.1 U7.14(REGOUT)

Not connected (* = marked no-connect by the designer): U7 7(RESV)

### Notes on the sheet
- (near C28) 1.8V~3.3V
- (near C31) 1.8V~3.3V

### Library data of the parts
C28-C31 = C: as C1 on sheet Power_1
U7 = ICM20608-G: 六轴姿态传感器

## Sheet LCD_ADS131A04.SchDoc
size A4; SheetNumber: 8; SheetTotal: 8
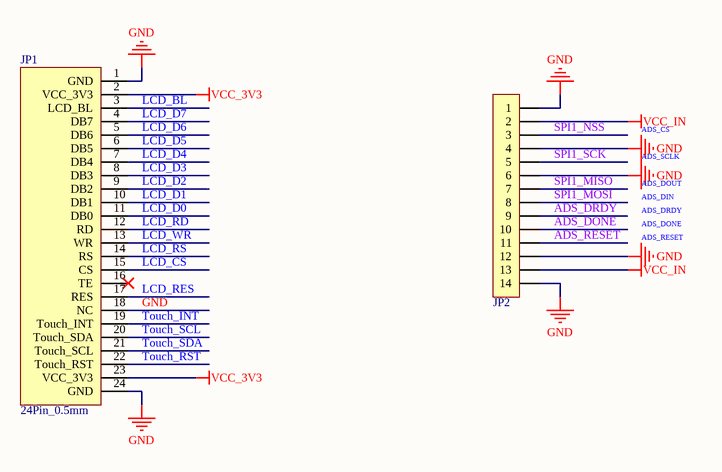
[diagram p7: LCD_ADS131A04.SchDoc]

### Parts
JP1  24Pin_0.5mm  [FPC0.5-WT-24P]
JP2  HDR-1X14  [FPC0.5-WT-14P]  (value not drawn)

### Nets
GND: JP1.1(GND) JP1.18(NC) JP1.24(GND) JP2.1 JP2.4 JP2.6 JP2.12 JP2.14
VCC_3V3: JP1.2(VCC_3V3) JP1.23(VCC_3V3)
VCC_IN: JP2.2 JP2.13
ADS_DONE: JP2.10
ADS_DRDY: JP2.9
ADS_RESET: JP2.11
LCD_BL: JP1.3(LCD_BL)
LCD_CS: JP1.15(CS)  [project net FSMC_NE1]
LCD_D0: JP1.11(DB0)  [project net FSMC_D0]
LCD_D1: JP1.10(DB1)  [project net FSMC_D1]
LCD_D2: JP1.9(DB2)  [project net FSMC_D2]
LCD_D3: JP1.8(DB3)  [project net FSMC_D3]
LCD_D4: JP1.7(DB4)  [project net FSMC_D4]
LCD_D5: JP1.6(DB5)  [project net FSMC_D5]
LCD_D6: JP1.5(DB6)  [project net FSMC_D6]
LCD_D7: JP1.4(DB7)  [project net FSMC_D7]
LCD_RD: JP1.12(RD)  [project net FSMC_NOE]
LCD_RES: JP1.17(RES)
LCD_RS: JP1.14(RS)  [project net FSMC_A16]
LCD_WR: JP1.13(WR)  [project net FSMC_NWE]
SPI1_MISO: JP2.7
SPI1_MOSI: JP2.8
SPI1_NSS: JP2.3
SPI1_SCK: JP2.5
Touch_INT: JP1.19(Touch_INT)
Touch_RST: JP1.22(Touch_RST)
Touch_SCL: JP1.20(Touch_SDA)  [project net I2C1_SCL]
Touch_SDA: JP1.21(Touch_SCL)  [project net I2C1_SDA]

Not connected (* = marked no-connect by the designer): JP1 16(TE)*

### Notes on the sheet
- ADS_CS
- ADS_SCLK
- ADS_DOUT
- ADS_DIN
- ADS_DRDY
- ADS_DONE
- ADS_RESET

### Library data of the parts
JP1 = 屏幕板FPC: 屏幕板外接座
JP2 = Header 14: 14P接插件; 封装库来自淘宝卖家 ID：黄晶宝石: 其他店铺购入均为盗版假冒封装库; 联系卖家，免费查找封装: 唯一出售店铺网址https://shop463601444.taobao.com; BOM名称: 14P接插件

## Nets that join several sheets
GND: Power_1 (26 pins), Power_2 (15 pins), STM32F407VG_A (C13.1 C14.1 JP3.5 R22.1), STM32F407VG_B (25 pins), Flash (C12.1 U4.4), SDCard (15 pins), ICM20608 (11 pins), LCD_ADS131A04 (8 pins)
VCC_3V3: Power_2 (5 pins), STM32F407VG_A (R23.1 SW1.2), STM32F407VG_B (20 pins), Flash (C12.2 U4.3 U4.7 U4.8), SDCard (R41.1), ICM20608 (5 pins), LCD_ADS131A04 (JP1.2 JP1.23)
VCC_IN: Power_1 (D2.2 D3.2 Q6.2), Power_2 (9 pins), LCD_ADS131A04 (JP2.2 JP2.13)
VREF+: Power_2 (R14.2), STM32F407VG_B (C15.2 U5.21)
ADC1_IN1: Power_1 (R45.1 R46.2), STM32F407VG_A (U5.24)
ADS_DONE: STM32F407VG_B (U5.3), LCD_ADS131A04 (JP2.10)
ADS_DRDY: STM32F407VG_B (U5.2), LCD_ADS131A04 (JP2.9)
ADS_RESET: STM32F407VG_B (U5.4), LCD_ADS131A04 (JP2.11)
DC_Inter: Power_1 (C33.2 R42.1 R44.2), STM32F407VG_B (U5.98)
FSMC_A16: STM32F407VG_A (U5.58), LCD_ADS131A04 (JP1.14)
FSMC_D0: STM32F407VG_A (U5.61), LCD_ADS131A04 (JP1.11)
FSMC_D1: STM32F407VG_A (U5.62), LCD_ADS131A04 (JP1.10)
FSMC_D2: STM32F407VG_A (U5.81), LCD_ADS131A04 (JP1.9)
FSMC_D3: STM32F407VG_A (U5.82), LCD_ADS131A04 (JP1.8)
FSMC_D4: STM32F407VG_B (U5.38), LCD_ADS131A04 (JP1.7)
FSMC_D5: STM32F407VG_B (U5.39), LCD_ADS131A04 (JP1.6)
FSMC_D6: STM32F407VG_B (U5.40), LCD_ADS131A04 (JP1.5)
FSMC_D7: STM32F407VG_B (U5.41), LCD_ADS131A04 (JP1.4)
FSMC_NE1: STM32F407VG_A (U5.88), LCD_ADS131A04 (JP1.15)
FSMC_NOE: STM32F407VG_A (U5.85), LCD_ADS131A04 (JP1.12)
FSMC_NWE: STM32F407VG_A (U5.86), LCD_ADS131A04 (JP1.13)
I2C1_SCL: STM32F407VG_A (U5.92), LCD_ADS131A04 (JP1.20)
I2C1_SDA: STM32F407VG_A (U5.93), LCD_ADS131A04 (JP1.21)
ICM_CS: STM32F407VG_A (U5.96), ICM20608 (U7.5)
ICM_INT: STM32F407VG_A (U5.95), ICM20608 (U7.6)
KEY_DOWN: STM32F407VG_A (U5.34), STM32F407VG_B (R26.1 SW4.2)
KEY_OK: Power_1 (D1.1), STM32F407VG_A (U5.18)
KEY_PWR: Power_1 (D1.3 R9.1), STM32F407VG_B (SW2.2)
KEY_UP: STM32F407VG_A (U5.33), STM32F407VG_B (R25.1 SW3.2)
KEY_WKUP: STM32F407VG_A (U5.23), STM32F407VG_B (R47.1 SW6.2)
LCD_BL: STM32F407VG_B (U5.45), LCD_ADS131A04 (JP1.3)
LCD_RES: STM32F407VG_A (U5.16), LCD_ADS131A04 (JP1.17)
PWR_EN: Power_1 (R10.2), STM32F407VG_A (U5.63)
SDIO_CK: STM32F407VG_A (U5.80), SDCard (R37.1)
SDIO_CMD: STM32F407VG_A (U5.83), SDCard (R36.1)
SDIO_D0: STM32F407VG_A (U5.65), SDCard (R39.1)
SDIO_D1: STM32F407VG_A (U5.66), SDCard (R40.1)
SDIO_D2: STM32F407VG_A (U5.78), SDCard (R34.1)
SDIO_D3: STM32F407VG_A (U5.79), SDCard (R35.1)
SDIO_SW: STM32F407VG_A (U5.64), SDCard (R38.2 U6.12)
SPI1_MISO: STM32F407VG_A (U5.31), LCD_ADS131A04 (JP2.7)
SPI1_MOSI: STM32F407VG_A (U5.32), LCD_ADS131A04 (JP2.8)
SPI1_NSS: STM32F407VG_A (U5.67), LCD_ADS131A04 (JP2.3)
SPI1_SCK: STM32F407VG_A (U5.30), LCD_ADS131A04 (JP2.5)
SPI2_MISO: STM32F407VG_A (U5.53), Flash (U4.2), ICM20608 (U7.4)
SPI2_MOSI: STM32F407VG_A (U5.54), Flash (U4.5), ICM20608 (U7.3)
SPI2_NSS: STM32F407VG_A (U5.51), Flash (U4.1)
SPI2_SCK: STM32F407VG_A (U5.52), Flash (U4.6), ICM20608 (U7.2)
ST_USB_N: Power_1 (R4.2), STM32F407VG_A (U5.70)
ST_USB_P: Power_1 (R5.2), STM32F407VG_A (U5.71)
Touch_INT: STM32F407VG_A (U5.36), LCD_ADS131A04 (JP1.19)
Touch_RST: STM32F407VG_A (U5.17), LCD_ADS131A04 (JP1.22)
USB_Inter: Power_1 (C32.2 R24.1 R43.2), STM32F407VG_B (U5.97)